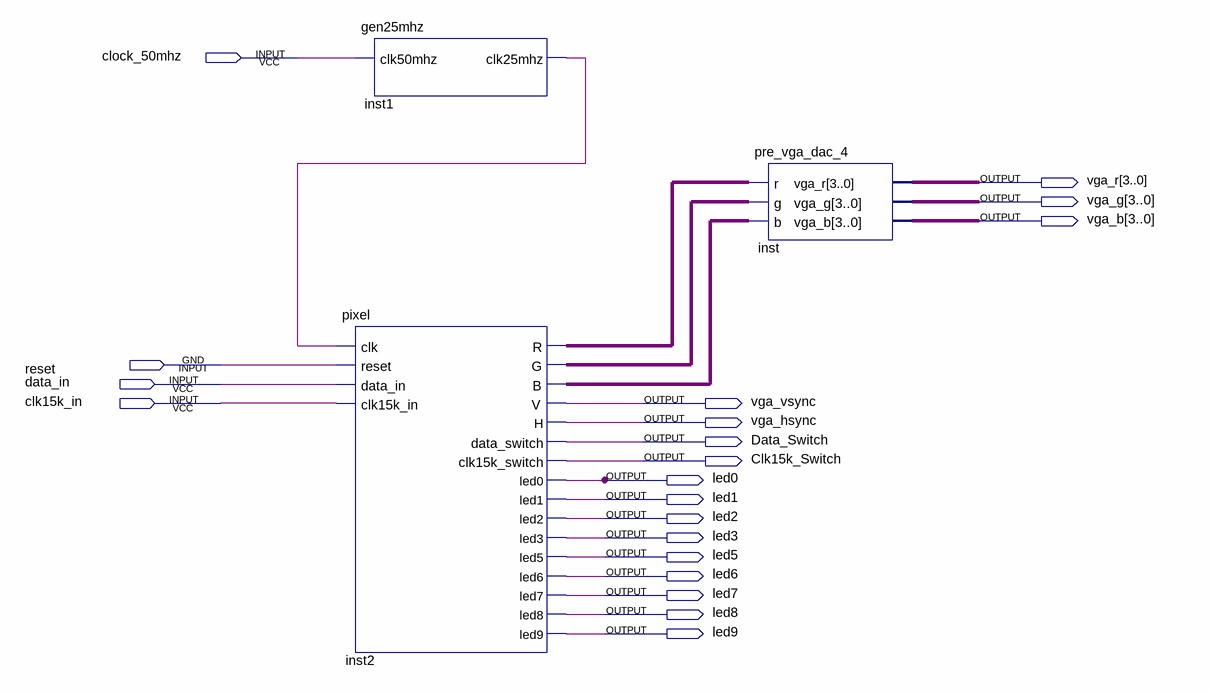
[diagram p0: schematic sheet]
// Quartus schematic top_de1.bdf as structural Verilog: 3 symbols, 20 pins
module top_de1 (
  input  clock_50mhz,
  input  reset,
  input  data_in,
  input  clk15k_in,
  output [3:0] vga_r,
  output [3:0] vga_g,
  output [3:0] vga_b,
  output vga_vsync,
  output vga_hsync,
  output Data_Switch,
  output Clk15k_Switch,
  output led0,
  output led1,
  output led2,
  output led3,
  output led5,
  output led6,
  output led7,
  output led8,
  output led9
);

  wire inst1_clk25mhz, inst2_b, inst2_g, inst2_r;

  pixel inst2 (
    .clk(inst1_clk25mhz), .reset(reset), .data_in(data_in), .clk15k_in(clk15k_in), .R(inst2_r), .G(inst2_g),
    .B(inst2_b), .V(vga_vsync), .H(vga_hsync), .data_switch(Data_Switch), .clk15k_switch(Clk15k_Switch),
    .led0(led0), .led1(led1), .led2(led2), .led3(led3), .led5(led5), .led6(led6), .led7(led7), .led8(led8),
    .led9(led9));
  gen25mhz inst1 (.clk50mhz(clock_50mhz), .clk25mhz(inst1_clk25mhz));
  pre_vga_dac_4 inst (.r(inst2_r), .g(inst2_g), .b(inst2_b), .vga_r(vga_r), .vga_g(vga_g), .vga_b(vga_b));
endmodule
